# EAGLE design ground_detector (EAGLE 5.06)
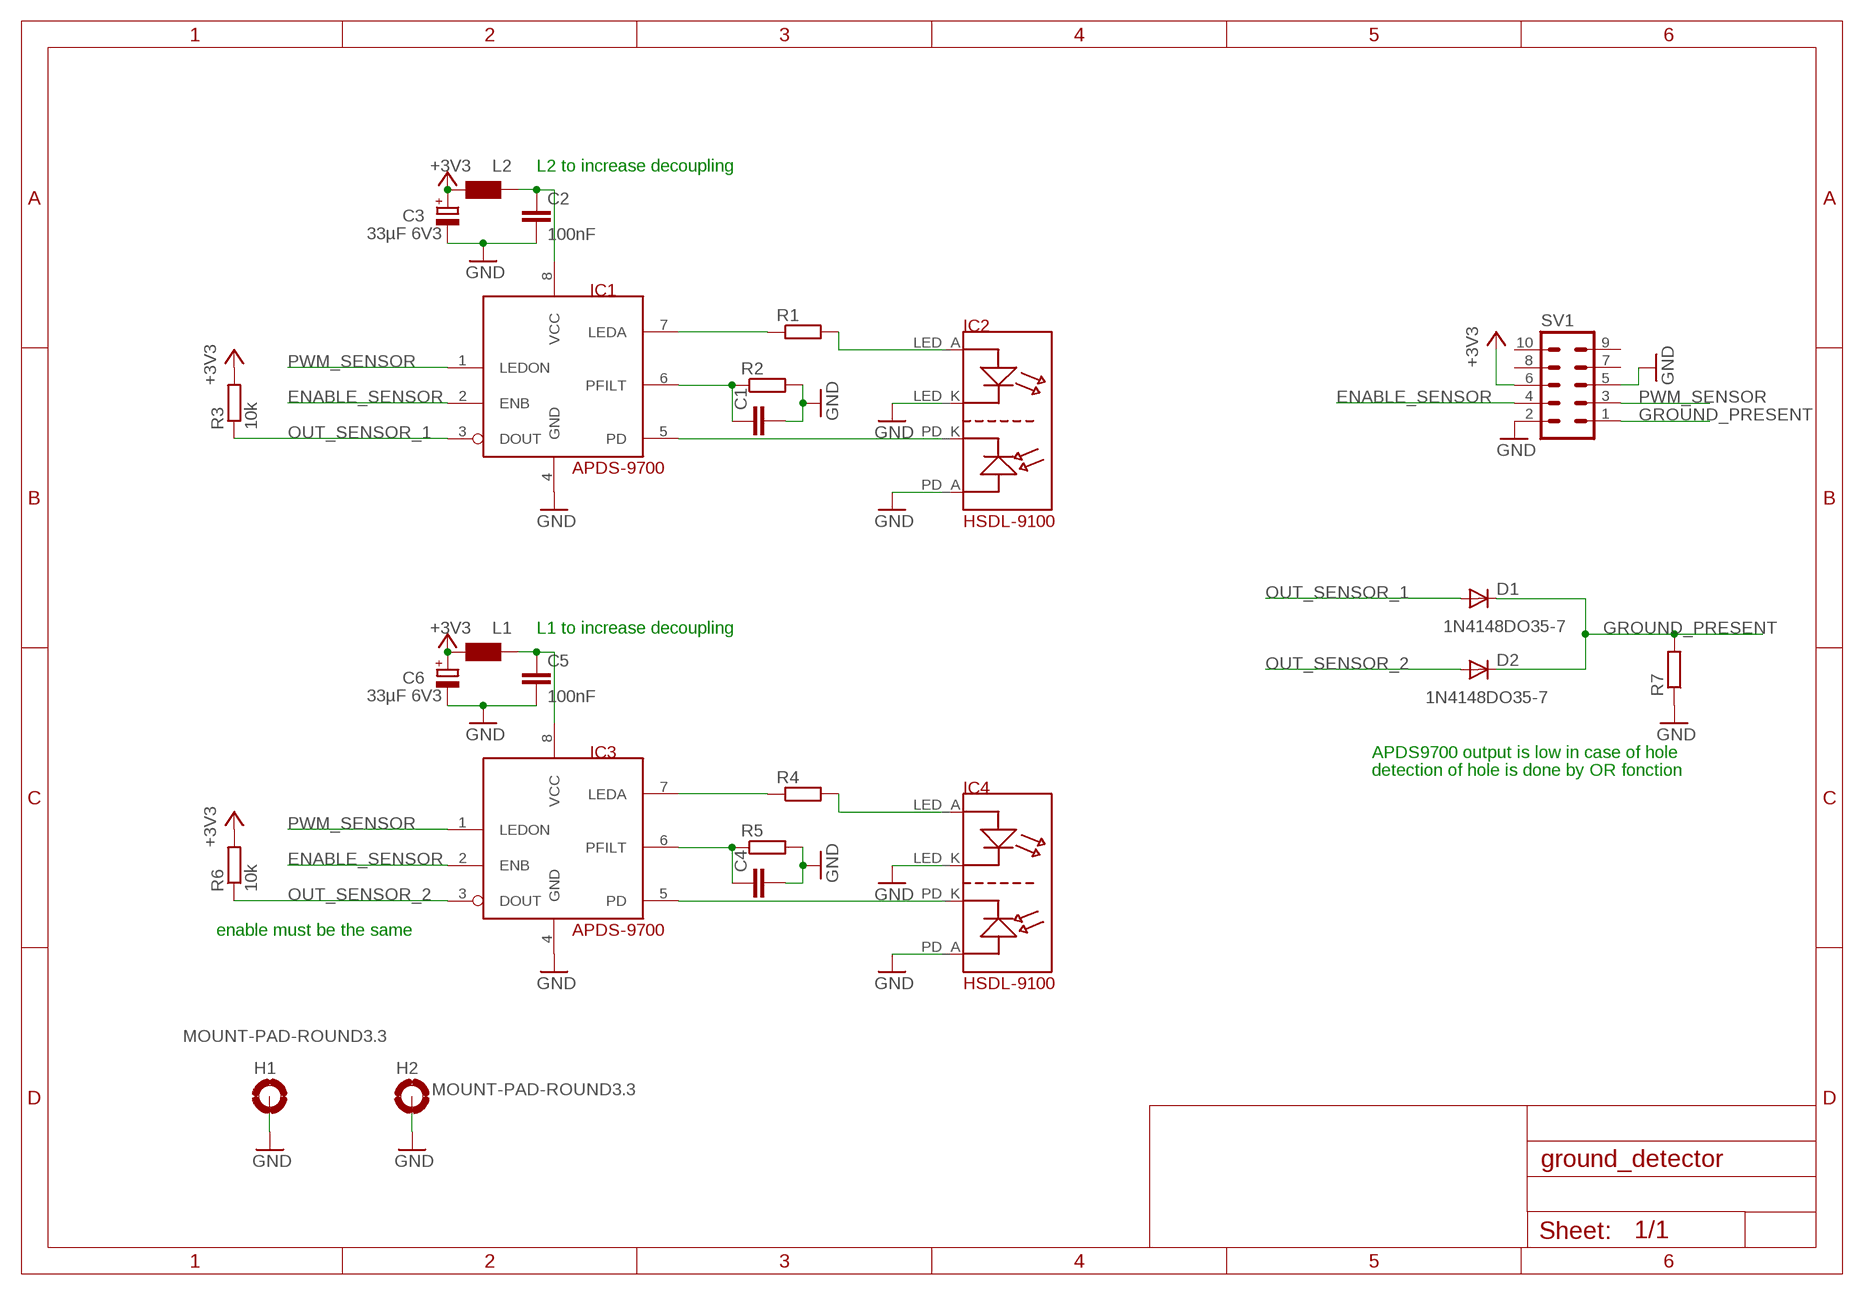
[diagram p0: schematic, sheet 1]

## Parts
C1  C-EUC0805  [C0805]
C2  100nF  C-EUC0603  [C0603]
C3  33µF 6V3  CPOL-EUD/7343-31W  [D/7343-31W]
C4  C-EUC0805  [C0805]
C5  100nF  C-EUC0603  [C0603]
C6  33µF 6V3  CPOL-EUD/7343-31W  [D/7343-31W]
D1  1N4148DO35-7  [DO35-7]
D2  1N4148DO35-7  [DO35-7]
H1  MOUNT-PAD-ROUND3.3  [3,3-PAD]
H2  MOUNT-PAD-ROUND3.3  [3,3-PAD]
IC1  APDS-9700  [QFN8]
IC2  HSDL-9100  [HSDL9100]
IC3  APDS-9700  [QFN8]
IC4  HSDL-9100  [HSDL9100]
L1  WE-MK_0805  [0805]
L2  WE-MK_0805  [0805]
R1  R-EU_R0805  [R0805]
R2  R-EU_R0805  [R0805]
R3  10k  R-EU_R0805  [R0805]
R4  R-EU_R0805  [R0805]
R5  R-EU_R0805  [R0805]
R6  10k  R-EU_R0805  [R0805]
R7  R-EU_R0805  [R0805]
SV1  ML10  [ML10]

## Nets
+3V3: C3.+ C6.+ L1.1 L2.1 R3.2 R6.2 SV1.6
ENABLE_SENSOR: IC1.2(ENB) IC3.2(ENB) SV1.4
GND: C1.2 C2.2 C3.- C4.2 C5.2 C6.- H1.B3,3(MOUNT) H2.B3,3(MOUNT) IC1.4(GND) IC2.LED_K IC2.PD_A IC3.4(GND) IC4.LED_K IC4.PD_A R2.2 R5.2 R7.1 SV1.2 SV1.5
GROUND_PRESENT: D1.C D2.C R7.2 SV1.1
N$1: IC1.5(PD) IC2.PD_K
N$2: C1.1 IC1.6(PFILT) R2.1
N$3: IC3.5(PD) IC4.PD_K
N$4: IC1.7(LEDA) R1.1
N$5: IC2.LED_A R1.2
N$6: C4.1 IC3.6(PFILT) R5.1
N$7: IC3.7(LEDA) R4.1
N$8: IC4.LED_A R4.2
N$9: C5.1 IC3.8(VCC) L1.2
N$10: C2.1 IC1.8(VCC) L2.2
OUT_SENSOR_1: D1.A IC1.3(DOUT) R3.1
OUT_SENSOR_2: D2.A IC3.3(DOUT) R6.1
PWM_SENSOR: IC1.1(LEDON) IC3.1(LEDON) SV1.3
Unconnected: SV1.7 SV1.8 SV1.9 SV1.10

## Notes on the sheet
- L2 to increase decoupling
- L1 to increase decoupling
- APDS9700 output is low in case of hole
- detection of hole is done by OR fonction
- enable must be the same

## Library data of the parts
C1 C2 C4 C5 = rcl:C-EU: CAPACITOR, European symbol
C3 C6 = rcl:CPOL-EU: POLARIZED CAPACITOR, European symbol
D1 D2 = diode:1N4148: DIODE high speed (Philips)
H1 H2 = holes:MOUNT-PAD-ROUND: MOUNTING PAD, round
IC1 IC3 = robotter:APDS-9700
IC2 IC4 = robotter:HSDL-9100
L1 L2 = wuerth-elektronik:WE-MK: SMD Multilayer Ceramic Inductors WE-MK - Windings printed on ceramic substrate - Extremely high SRF > 15 GHz - Inductance is stable over temperature -- High frequency circuits -- Bluetooth -- Wireless LAN -- Filter circuits
R1-R7 = rcl:R-EU_: RESISTOR, European symbol
SV1 = con-ml:ML10: HARTING

## Board
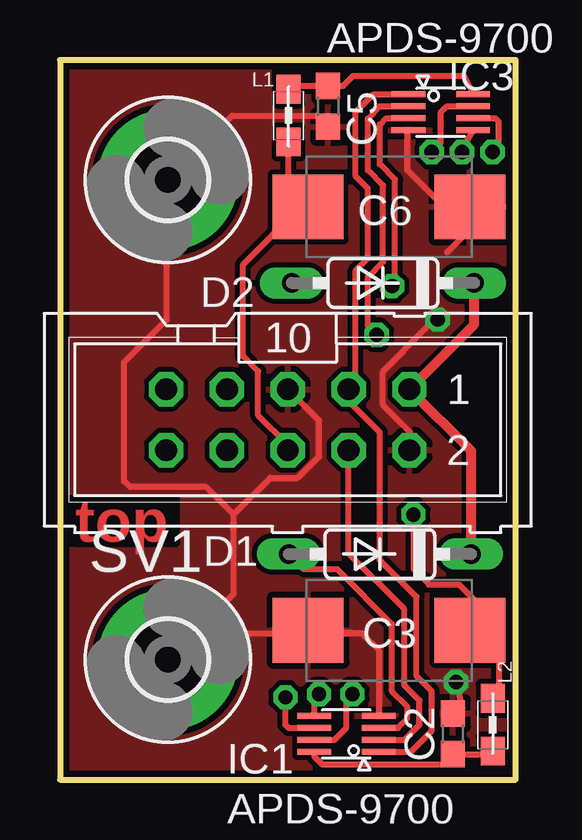
[diagram p1: board, top side]
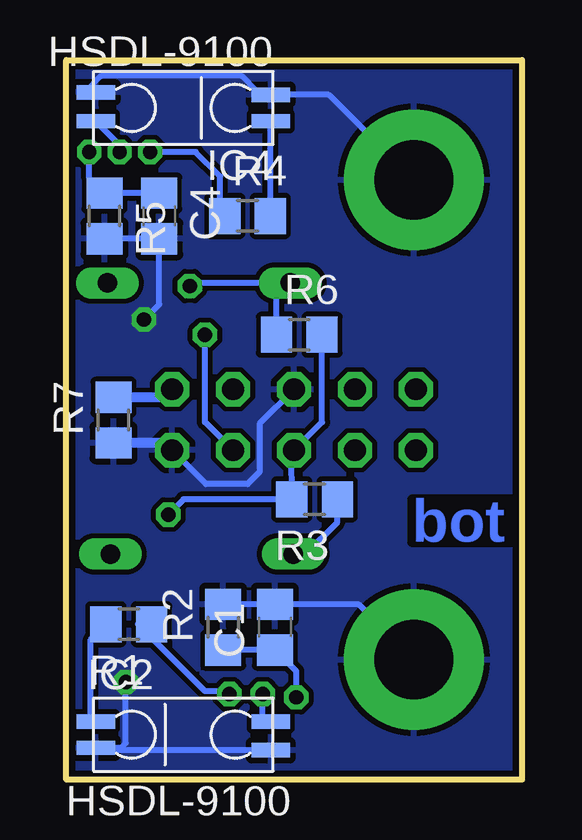
[diagram p2: board, bottom side, seen from below]

Size 19 x 30 mm. Coordinates in mm from the lower left corner, seen from the top.
Outline: 0,0 19,0 19,30 0,30 0,0
Copper layers (1*16): Top 0.035mm / dielectric 1.5mm / Bottom 0.035mm
Design rules "default *": minimum track width 8mil, minimum drill 0.6mm, track to track 8mil, track to pad 8mil, pad to pad 8mil, via to via 8mil, smd to smd 8mil, copper to edge 10mil, drill to drill 8mil, minimum pad ring 10mil, minimum via ring 8mil, stop-mask expansion 4mil, vias tented up to drill 0mil, thermal gap 10mil

### Footprints (pad centres in the part's own frame; a part is rotated, then mirrored left to right if it is on the bottom)
C0805 = smd 1.3 x 1.5: 1 -0.95,0; 2 0.95,0
C0603 = smd 1.1 x 1: 1 -0.85,0; 2 0.85,0
D/7343-31W = smd 2.95 x 2.7: + 3.375,0; - -3.375,0
DO35-7 = drill 0.813 long: A 3.81,0; C -3.81,0
3,3-PAD = drill 3.3 pad 5.842 round: B3,3 0,0
QFN8 = smd 1.4 x 0.25: 1 -1.35,0.75; 2 -1.35,0.25; 3 -1.35,-0.25; 4 -1.35,-0.75; 5 1.35,-0.75; 6 1.35,-0.25; 7 1.35,0.25; 8 1.35,0.75
HSDL9100 = smd 1.6 x 0.6: LED_A -3.65,0.55; LED_K -3.65,-0.55; PD_A 3.65,-0.65; PD_K 3.65,0.55
0805 = smd 1.2 x 1: 1 -1.1,0; 2 1.1,0
R0805 = smd 1.3 x 1.5: 1 -0.95,0; 2 0.95,0
ML10 = drill 0.914 octagon: 1 -5.08,-1.27; 2 -5.08,1.27; 3 -2.54,-1.27; 4 -2.54,1.27; 5 0,-1.27; 6 0,1.27; 7 2.54,-1.27; 8 2.54,1.27; 9 5.08,-1.27; 10 5.08,1.27

### Placement (x,y rotation side)
C1  10.29,6.35 90 bottom
C2  16.39,1.91 90 top
C3  13.72,6.22 0 top
C4  15.12,23.5 270 bottom
C5  11.18,28.07 270 top
C6  13.72,23.88 180 top
D1  13.34,9.4 180 top
D2  13.47,20.7 180 top
H1  4.5,5 0 top
H2  4.5,25 0 top
IC1  11.95,1.91 180 top
IC2  14.12,1.87 0 bottom
IC3  15.88,27.81 0 top
IC4  14.12,28 180 bottom
L1  9.53,27.69 90 top
L2  18.04,2.29 270 top
R1  16.39,6.48 180 bottom
R2  12.45,6.35 90 bottom
R3  8.64,11.68 180 bottom
R4  11.44,23.5 0 bottom
R5  17.41,23.5 270 bottom
R6  9.28,18.54 0 bottom
R7  17.03,14.99 90 bottom
SV1  9.5,15 180 top

### Tracks (layer width: path | path; a pad name or v marks a point on that pad's centre or on a via)
+3V3  (via drill 0.6 pad 1.02)
  Top 0.254: SV1.6 9.5,13.94 8.26,15.18 8.26,17.02 7.63,17.65 7.63,21.46 10.04,23.88 C6.+ 9.91,24.82 9.53,25.2 L1.1 | v14.74,11.05 14.74,8.76 15.38,8.13 16.64,8.13 17.73,7.04 C3.+ 18.3,6.1 18.3,3.64 L2.1
  Bottom 0.254: R6.2 8.33,14.9 SV1.6 9.6,13.63 R3.2 14.11,11.68 v14.74,11.05
ENABLE_SENSOR  (via drill 0.6 pad 1.02)
  Top 0.254: IC1.2 14.36,1.66 14.99,2.29 14.99,3.3 14.36,3.94 14.36,7.11 12.04,9.43 SV1.4 | v13.22,18.54 12.84,18.92 12.84,20.95 13.47,21.59 13.47,24.77 12.84,25.4 12.84,27.56 13.34,28.06 IC3.2
  Bottom 0.254: v13.22,18.54 13.22,14.91 SV1.4
GND  (via drill 0.6 pad 1.02)
  Top 0.254: IC1.4 13.3,5.38 12.58,6.1 | 12.58,6.1 C3.- | v16.52,4.06 16.77,2.92 16.52,2.67 C2.2 | 16.14,21.97 17.61,23.44 C6.- 17.48,24 15.88,24 14.49,25.4 14.49,27.02 IC3.4 | SV1.2 14.61,13.76 14.61,14.48 13.47,15.62 13.47,17.02 15.25,18.8 15.63,19.18 v15.76,19.18 | SV1.5 10.8,14.97 10.8,13.46 9.91,12.57 8.77,12.57 7.25,11.05 | 4.45,24.95 4.45,19.18 2.67,17.4 2.67,12.45 2.93,12.19 6.1,12.19 7.25,11.05 | 12.58,6.1 5.6,6.1 H1.B3,3 7.25,7.75 7.25,11.05 | C5.2 10.71,27.69 7.19,27.69 H2.B3,3
  Bottom 0.254: R2.2 C1.2 6.8,7.3 H1.B3,3 | R5.2 C4.2 15.12,19.81 v15.76,19.18 | SV1.5 10.93,14.84 10.93,12.83 11.44,12.32 13.17,12.32 SV1.2 | IC4.PD_A 18.17,28.7 17.53,29.34 11.69,29.34 11.06,28.7 11.03,28.55 IC4.LED_K 8.05,28.55 H2.B3,3 | IC2.PD_A 17.67,1.22 IC2.LED_K 16.72,1.32 16.52,1.52 v16.52,4.06
  Bottom 0.406: R7.1 14.89,14.04 SV1.2
  pour Top: -0.5,0 19.57,0 19.57,29.84 19.44,29.97 -0.5,29.97
  pour Bottom: -0.5,0 19.44,0 19.44,0.38 19.44,29.97 -0.5,29.97
GROUND_PRESENT
  Top 0.406: D2.C 17.28,18.97 SV1.1 17.15,13.7 D1.C
  Bottom 0.406: R7.2 14.91,15.94 SV1.1
N$1  (via drill 0.6 pad 1.02)
  Top 0.254: IC1.5 10.6,3.22 v10.8,3.56
  Bottom 0.254: v10.8,3.56 10.8,2.6 IC2.PD_K
N$2  (via drill 0.6 pad 1.02)
  Top 0.254: IC1.6 9.54,2.15 9.41,2.29 v9.41,3.43
  Bottom 0.254: R2.1 C1.1 9.41,4.51 v9.41,3.43
N$3  (via drill 0.6 pad 1.02)
  Top 0.254: IC3.5 16.77,26.35 v16.77,26.16
  Bottom 0.254: v16.77,26.16 16.9,26.58 IC4.PD_K
N$4  (via drill 0.6 pad 1.02)
  Top 0.254: IC1.7 11.44,1.66 11.95,2.16 11.95,3.3 v12.2,3.56
  Bottom 0.254: v12.2,3.56 12.33,3.68 13.22,3.68 16.01,6.48 R1.1
N$5
  Bottom 0.254: IC2.LED_A 17.98,2.6 17.98,5.84 R1.2
N$6  (via drill 0.6 pad 1.02)
  Top 0.254: IC3.6 17.62,27.56 18.17,27.56 18.3,27.43 18.3,26.42 v18.04,26.16
  Bottom 0.254: C4.1 R5.1 18.04,25.08 v18.04,26.16
N$7  (via drill 0.6 pad 1.02)
  Top 0.254: IC3.7 16.13,28.06 15.88,27.81 15.88,26.54 v15.5,26.16
  Bottom 0.254: v15.5,26.16 13.6,26.16 12.58,25.15 12.58,23.5 R4.1
N$8
  Bottom 0.254: R4.2 10.49,27.09 IC4.LED_A
N$9
  Top 0.254: L1.2 10.04,28.92 C5.1 11.82,28.92 12.24,29.34 16.84,29.34 IC3.8
N$10
  Top 0.254: IC1.8 10.6,0.97 10.93,0.64 16.26,0.64 16.77,0.89 C2.1 18.16,1.05 L2.2
OUT_SENSOR_1
  Top 0.254: IC1.3 14.1,2.15 14.49,2.54 14.49,3.05 13.85,3.68 13.85,6.48 11.56,8.76 11.06,8.76 10.17,8.76 D1.A
  Bottom 0.254: R3.1 7.69,10.73 9.03,9.4 D1.A
OUT_SENSOR_2  (via drill 0.6 pad 1.02)
  Top 0.254: IC3.3 13.6,27.56 13.34,27.3 13.34,25.65 13.98,25.02 13.98,20.7 v13.85,20.57
  Bottom 0.254: R6.1 10.23,20.51 D2.A 13.72,20.7 v13.85,20.57
PWM_SENSOR
  Top 0.254: IC1.1 14.62,1.16 15.5,2.03 15.5,3.68 14.87,4.32 14.87,7.62 13.34,9.14 13.34,14.48 12.04,15.78 SV1.3 12.33,16.56 12.33,21.21 12.84,21.72 12.84,24.64 12.33,25.15 12.33,27.81 13.08,28.56 IC3.1

### Text on the board
Top: top
Bottom: bot